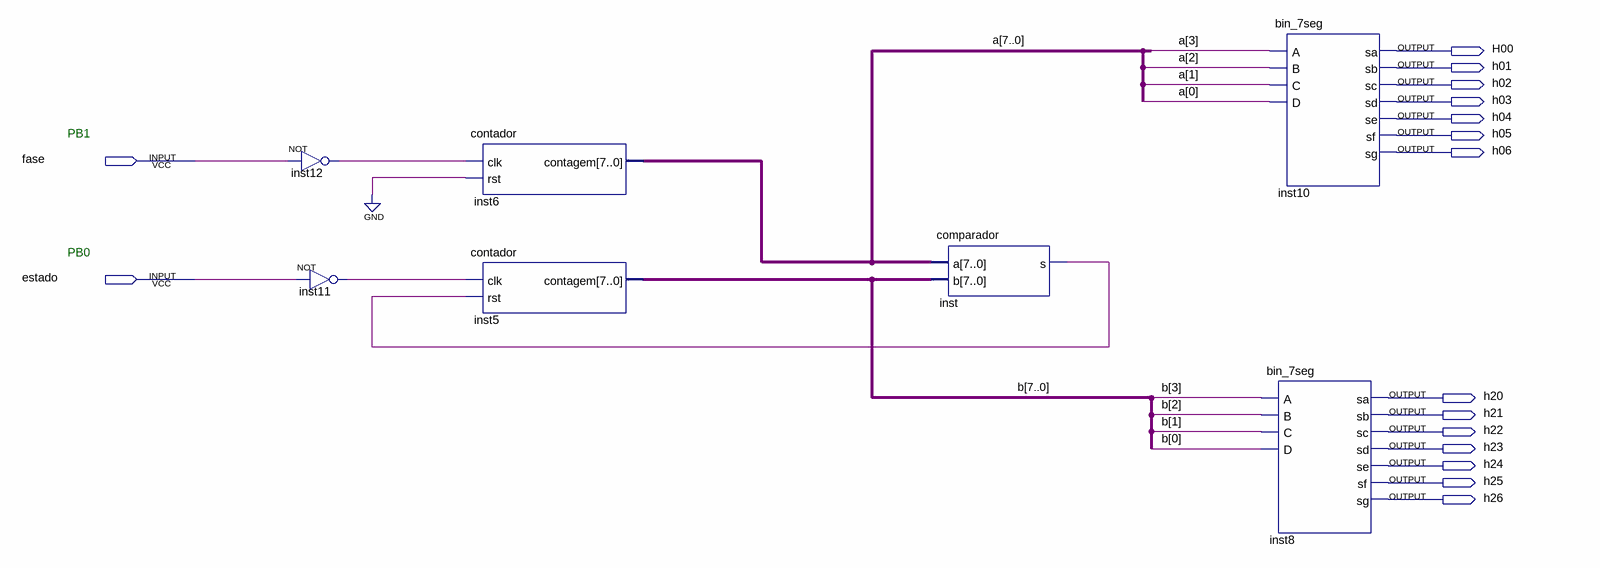
[diagram p0: schematic sheet]
// Quartus schematic projeto_final.bdf as structural Verilog: 7 symbols, 16 pins
module projeto_final (
  input  fase,
  input  estado,
  output H00,
  output h01,
  output h02,
  output h03,
  output h04,
  output h05,
  output h06,
  output h20,
  output h21,
  output h22,
  output h23,
  output h24,
  output h25,
  output h26
);

  wire inst11_out, inst12_out, inst_s;
  wire [7:0] a, b;

  not inst12 (inst12_out, fase);
  not inst11 (inst11_out, estado);
  contador inst6 (.clk(inst12_out), .rst(1'b0), .contagem(a));
  contador inst5 (.clk(inst11_out), .rst(inst_s), .contagem(b));
  comparador inst (.a(a), .b(b), .s(inst_s));
  bin_7seg inst10 (
    .A(a[3]), .B(a[2]), .C(a[1]), .D(a[0]), .sa(H00), .sb(h01), .sc(h02), .sd(h03), .se(h04), .sf(h05),
    .sg(h06));
  bin_7seg inst8 (
    .A(b[3]), .B(b[2]), .C(b[1]), .D(b[0]), .sa(h20), .sb(h21), .sc(h22), .sd(h23), .se(h24), .sf(h25),
    .sg(h26));

  // Notes on the sheet:
  //   PB1
  //   PB0
endmodule
